# Altium schematic sheet 02-Insence_interface_xx.SchDoc
size C; SheetNumber: 2
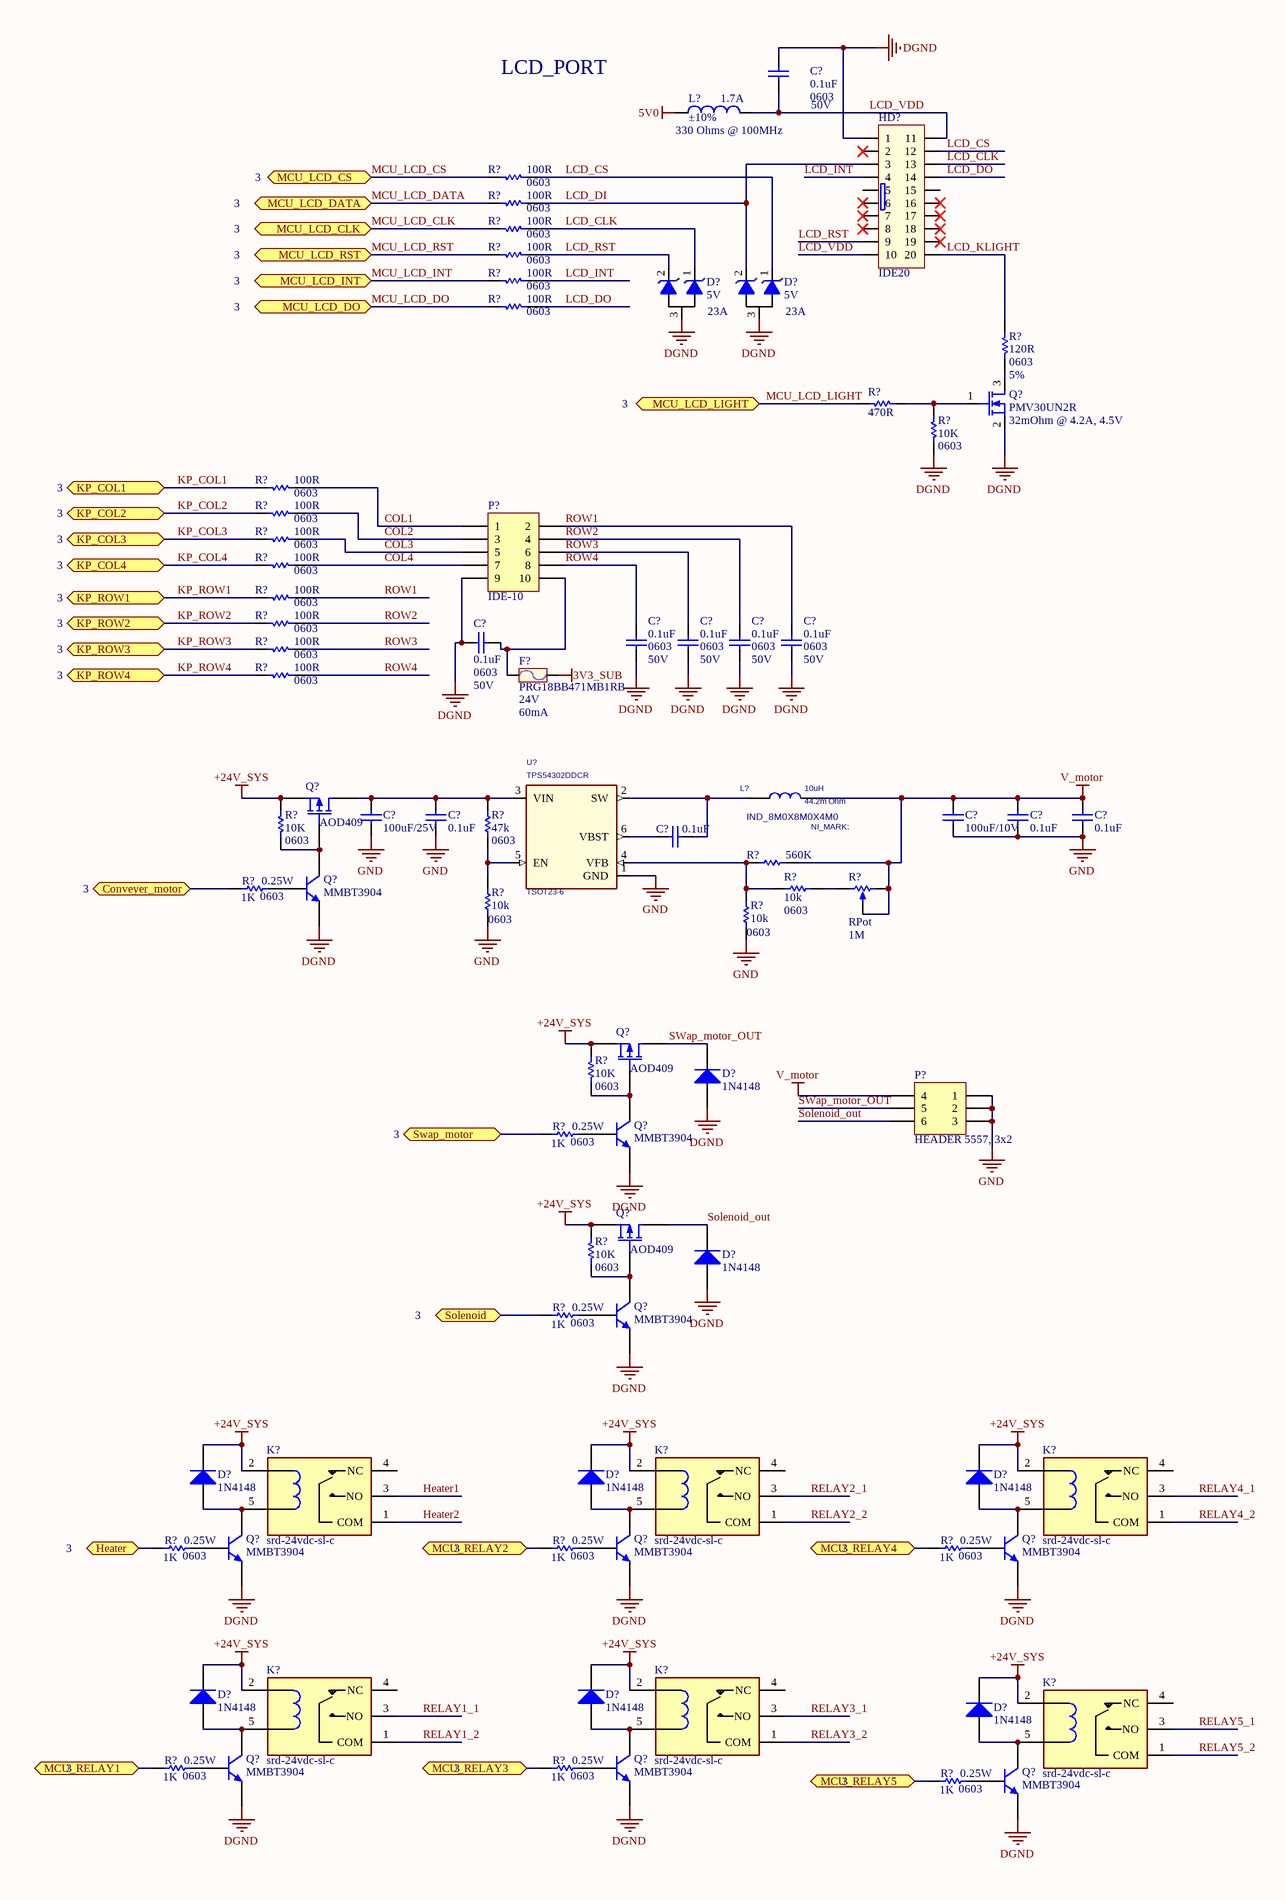
[diagram p0: 02-Insence_interface_xx.SchDoc, left]
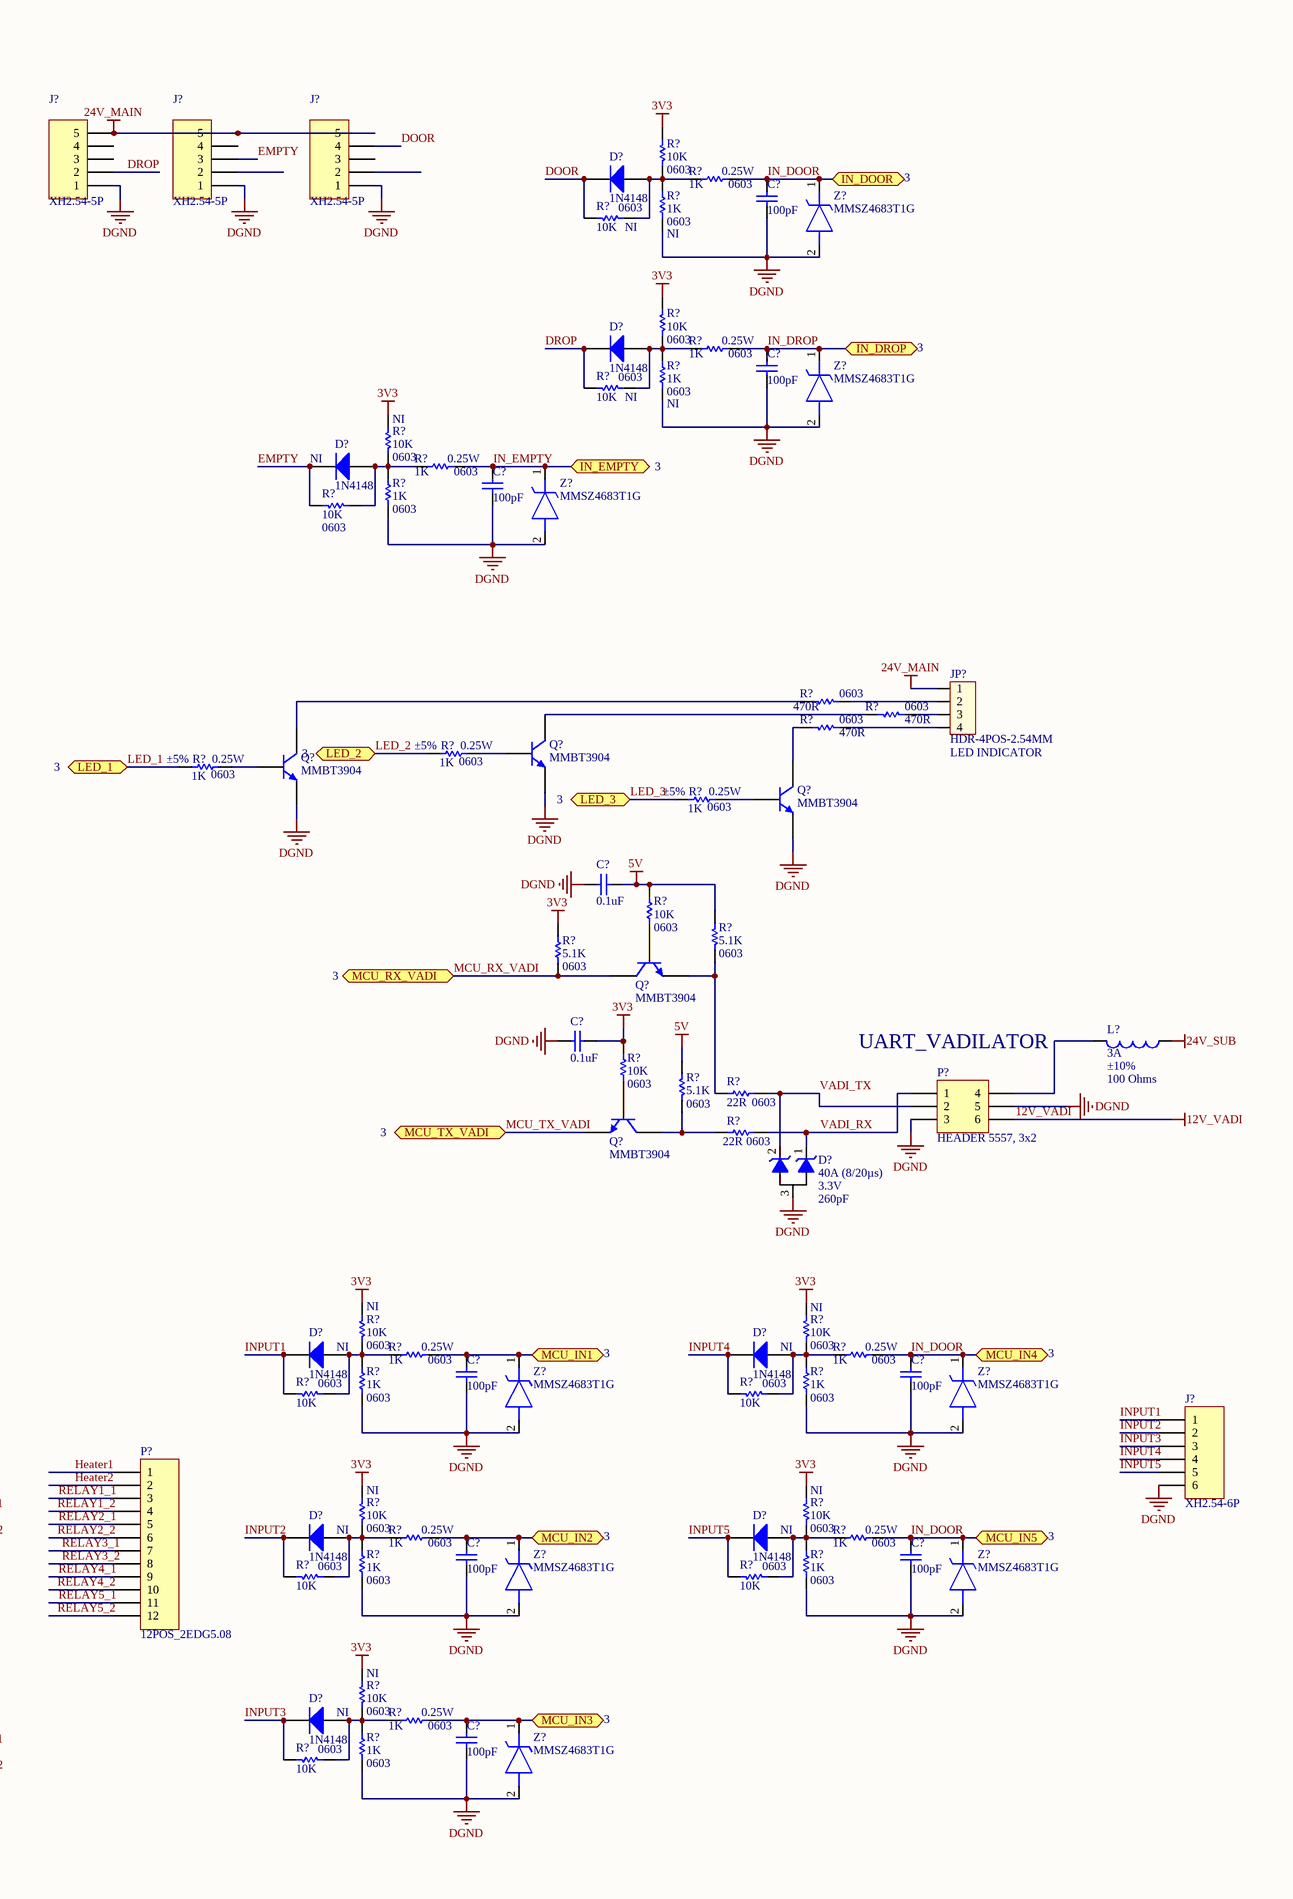
[diagram p1: 02-Insence_interface_xx.SchDoc, right]

## Parts
(Parts that share a designator on the sheet are numbered #1, #2 ... from top to bottom, then left to right.)
C?#1  FOOTPRINT: 0603  Voltage: 50V  [CAP 0603]  (hidden comment: 0.1uF)
C?#2  100pF  [CAP 0603]
C?#3  100pF  [CAP 0603]
C?#4  100pF  [CAP 0603]
C?#5  FOOTPRINT: 0603  Voltage: 50V  [CAP 0603]  (hidden comment: 0.1uF)
C?#6  FOOTPRINT: 0603  Voltage: 50V  [CAP 0603]  (hidden comment: 0.1uF)
C?#7  FOOTPRINT: 0603  Voltage: 50V  [CAP 0603]  (hidden comment: 0.1uF)
C?#8  FOOTPRINT: 0603  Voltage: 50V  [CAP 0603]  (hidden comment: 0.1uF)
C?#9  FOOTPRINT: 0603  Voltage: 50V  [CAP 0603]  (hidden comment: 0.1uF)
C?#10  =Value: 100uF/25V  [SMC_E/WA]  (hidden comment: Capacitor Tantalum,100uF,25V, 7343)
C?#11  =Value: 0.1uF  [0805]  (hidden comment: Cap)
C?#12  =Value: 0.1uF  [0805]  (hidden comment: Cap)
C?#13  =Value: 100uF/10V  [SMC_D/WA]  (hidden comment: Cap)
C?#14  =Value: 0.1uF  [0805]  (hidden comment: Cap)
C?#15  =Value: 0.1uF  [0805]  (hidden comment: Cap)
C?#16  0.1uF  [CAP 0603]
C?#17  0.1uF  [CAP 0603]
C?#18  100pF  [CAP 0603]
C?#19  100pF  [CAP 0603]
C?#20  100pF  [CAP 0603]
C?#21  100pF  [CAP 0603]
C?#22  100pF  [CAP 0603]
D?#1  1N4148  [diode_1206]
D?#2  CURRENT: 23A  VOLTAGE: 5V  [SOT-23-3]  (hidden comment: HSM05-TP)
D?#3  CURRENT: 23A  VOLTAGE: 5V  [SOT-23-3]  (hidden comment: HSM05-TP)
D?#4  1N4148  [diode_1206]
D?#5  1N4148  Assembly: NI  [diode_1206]
D?#6  1N4148  [diode_1206]
D?#7  CURRENT: 40A (8/20µs)  VOLTAGE: 3.3V  Junction Capacitance: 260pF  [SOT-23-3]  (hidden comment: SM3.3H-TP)
D?#8  1N4148  [diode_1206]
D?#9  1N4148  Assembly: NI  [diode_1206]
D?#10  1N4148  Assembly: NI  [diode_1206]
D?#11  1N4148  [diode_1206]
D?#12  1N4148  [diode_1206]
D?#13  1N4148  [diode_1206]
D?#14  1N4148  Assembly: NI  [diode_1206]
D?#15  1N4148  Assembly: NI  [diode_1206]
D?#16  1N4148  [diode_1206]
D?#17  1N4148  [diode_1206]
D?#18  1N4148  [diode_1206]
D?#19  1N4148  Assembly: NI  [diode_1206]
F?  PRG18BB471MB1RB  Voltage - Rated: 24V  Current Rating (Amps): 60mA  [FB 0603]
HD?  IDE20  [SHDR20W65P254_2X10_3302X900X900P]
J?#1  XH2.54-5P  [HDR1X5]
J?#2  XH2.54-5P  [HDR1X5]
J?#3  XH2.54-5P  [HDR1X5]
J?#4  XH2.54-6P  [HDR1X6]
JP?  HDR-4POS-2.54MM  CONNECTION: LED INDICATOR  [XH2.54-4P]
K?#1  srd-24vdc-sl-c  [srd24vdcslc]
K?#2  srd-24vdc-sl-c  [srd24vdcslc]
K?#3  srd-24vdc-sl-c  [srd24vdcslc]
K?#4  srd-24vdc-sl-c  [srd24vdcslc]
K?#5  srd-24vdc-sl-c  [srd24vdcslc]
K?#6  srd-24vdc-sl-c  [srd24vdcslc]
L?#1  Current: 1.7A  Tolerance: ±10%  [FB 0603]  (hidden comment: 330 Ohms @ 100MHz)
L?#2  10uH  PACKAGE: IND_8M0X8M0X4M0  DCR: 44.2m Ohm  [Inductor_5X5]
L?#3  value 100 Ohms  Current: 3A  Tolerance: ±10%  [FB 0603]  (hidden comment: MPZ1608S101ATAH0)
P?#1  IDE-10  [IDE-10]
P?#2  HEADER 5557, 3x2  [HDR2X3_CEN]
P?#3  HEADER 5557, 3x2  [HDR2X3_CEN]
P?#4  12POS_2EDG5.08  [Jack_12_2EDG508]
Q?#1  PMV30UN2R  RDSON: 32mOhm @ 4.2A, 4.5V  [SOT-23-3]
Q?#2  MMBT3904  [SOT-23]
Q?#3  MMBT3904  [SOT-23]
Q?#4  MMBT3904  [SOT-23]
Q?#5  AOD409  [E3]
Q?#6  MMBT3904  [SOT-23]
Q?#7  MMBT3904  [SOT-23]
Q?#8  AOD409  [E3]
Q?#9  MMBT3904  [SOT-23]
Q?#10  MMBT3904  [SOT-23]
Q?#11  AOD409  [E3]
Q?#12  MMBT3904  [SOT-23]
Q?#13  MMBT3904  [SOT-23]
Q?#14  MMBT3904  [SOT-23]
Q?#15  MMBT3904  [SOT-23]
Q?#16  MMBT3904  [SOT-23]
Q?#17  MMBT3904  [SOT-23]
Q?#18  MMBT3904  [SOT-23]
R?#1  PCB Footprint: 0603  [res 0603]  (hidden comment: 10K)
R?#2  PCB_ Footprint: 0603  [res 0603]  (hidden comment: 100R)
R?#3  PCB Footprint: 0603  Assembly: NI  [res 0603]  (hidden comment: 1K)
R?#4  PCB Footprint: 0603  Power: 0.25W  [res 0603]  (hidden comment: 1K)
R?#5  PCB_ Footprint: 0603  [res 0603]  (hidden comment: 100R)
R?#6  PCB Footprint: 0603  Assembly: NI  [res 0603]  (hidden comment: 10K)
R?#7  PCB_ Footprint: 0603  [res 0603]  (hidden comment: 100R)
R?#8  PCB_ Footprint: 0603  [res 0603]  (hidden comment: 100R)
R?#9  PCB_ Footprint: 0603  [res 0603]  (hidden comment: 100R)
R?#10  PCB Footprint: 0603  [res 0603]  (hidden comment: 10K)
R?#11  PCB_ Footprint: 0603  [res 0603]  (hidden comment: 100R)
R?#12  PCB_ Footprint: 0603  Tolerance: 5%  [res 0603]  (hidden comment: 120R)
R?#13  PCB Footprint: 0603  Assembly: NI  [res 0603]  (hidden comment: 1K)
R?#14  PCB Footprint: 0603  Power: 0.25W  [res 0603]  (hidden comment: 1K)
R?#15  470R  [res 0603]
R?#16  PCB Footprint: 0603  Assembly: NI  [res 0603]  (hidden comment: 10K)
R?#17  PCB Footprint: 0603  [res 0603]  (hidden comment: 10K)
R?#18  PCB Footprint: 0603  Asembly: NI  [res 0603]  (hidden comment: 10K)
R?#19  PCB Footprint: 0603  [res 0603]  (hidden comment: 1K)
R?#20  PCB Footprint: 0603  Power: 0.25W  [res 0603]  (hidden comment: 1K)
R?#21  PCB_ Footprint: 0603  [res 0603]  (hidden comment: 100R)
R?#22  PCB Footprint: 0603  [res 0603]  (hidden comment: 10K)
R?#23  PCB_ Footprint: 0603  [res 0603]  (hidden comment: 100R)
R?#24  PCB_ Footprint: 0603  [res 0603]  (hidden comment: 100R)
R?#25  PCB_ Footprint: 0603  [res 0603]  (hidden comment: 100R)
R?#26  PCB_ Footprint: 0603  [res 0603]  (hidden comment: 100R)
R?#27  PCB_ Footprint: 0603  [res 0603]  (hidden comment: 100R)
R?#28  PCB_ Footprint: 0603  [res 0603]  (hidden comment: 100R)
R?#29  PCB Footprint: 0603  [res 0603]  (hidden comment: 470R)
R?#30  PCB_ Footprint: 0603  [res 0603]  (hidden comment: 100R)
R?#31  PCB Footprint: 0603  [res 0603]  (hidden comment: 470R)
R?#32  PCB Footprint: 0603  [res 0603]  (hidden comment: 470R)
R?#33  PCB Footprint: 0603  Power: 0.25W  Tolerance: ±5%  [res 0603]  (hidden comment: 1K)
R?#34  PCB Footprint: 0603  Power: 0.25W  Tolerance: ±5%  [res 0603]  (hidden comment: 1K)
R?#35  PCB Footprint: 0603  Power: 0.25W  Tolerance: ±5%  [res 0603]  (hidden comment: 1K)
R?#36  PCB Footprint: 0603  [res 0603]  (hidden comment: 10K)
R?#37  value 47k  Footprint: 0603  [res 0603]  (hidden comment: Res1)
R?#38  value 560K  [0805]  (hidden comment: Res1)
R?#39  value 10k  Footprint: 0603  [res 0603]  (hidden comment: Res1)
R?#40  value 10k  Footprint: 0603  [res 0603]  (hidden comment: Res1)
R?#41  PCB Footprint: 0603  [res 0603]  (hidden comment: 10K)
R?#42  PCB Footprint: 0603  Power: 0.25W  [res 0603]  (hidden comment: 1K)
R?#43  value 10k  Footprint: 0603  [res 0603]  (hidden comment: Res1)
R?#44  RPot  value 1M  [VR5]
R?#45  PCB Footprint: 0603  [res 0603]  (hidden comment: 5.1K)
R?#46  PCB Footprint: 0603  [res 0603]  (hidden comment: 5.1K)
R?#47  PCB Footprint: 0603  [res 0603]  (hidden comment: 10K)
R?#48  PCB Footprint: 0603  [res 0603]  (hidden comment: 10K)
R?#49  PCB Footprint: 0603  [res 0603]  (hidden comment: 5.1K)
R?#50  PCB Footprint: 0603  [res 0603]  (hidden comment: 22R)
R?#51  PCB Footprint: 0603  [res 0603]  (hidden comment: 22R)
R?#52  PCB Footprint: 0603  Power: 0.25W  [res 0603]  (hidden comment: 1K)
R?#53  PCB Footprint: 0603  [res 0603]  (hidden comment: 10K)
R?#54  PCB Footprint: 0603  Assembly: NI  [res 0603]  (hidden comment: 10K)
R?#55  PCB Footprint: 0603  Assembly: NI  [res 0603]  (hidden comment: 10K)
R?#56  PCB Footprint: 0603  Power: 0.25W  [res 0603]  (hidden comment: 1K)
R?#57  PCB Footprint: 0603  [res 0603]  (hidden comment: 1K)
R?#58  PCB Footprint: 0603  Power: 0.25W  [res 0603]  (hidden comment: 1K)
R?#59  PCB Footprint: 0603  [res 0603]  (hidden comment: 1K)
R?#60  PCB Footprint: 0603  Power: 0.25W  [res 0603]  (hidden comment: 1K)
R?#61  PCB Footprint: 0603  [res 0603]  (hidden comment: 10K)
R?#62  PCB Footprint: 0603  [res 0603]  (hidden comment: 10K)
R?#63  PCB Footprint: 0603  Assembly: NI  [res 0603]  (hidden comment: 10K)
R?#64  PCB Footprint: 0603  Assembly: NI  [res 0603]  (hidden comment: 10K)
R?#65  PCB Footprint: 0603  [res 0603]  (hidden comment: 1K)
R?#66  PCB Footprint: 0603  Power: 0.25W  [res 0603]  (hidden comment: 1K)
R?#67  PCB Footprint: 0603  [res 0603]  (hidden comment: 1K)
R?#68  PCB Footprint: 0603  Power: 0.25W  [res 0603]  (hidden comment: 1K)
R?#69  PCB Footprint: 0603  Power: 0.25W  [res 0603]  (hidden comment: 1K)
R?#70  PCB Footprint: 0603  Power: 0.25W  [res 0603]  (hidden comment: 1K)
R?#71  PCB Footprint: 0603  Power: 0.25W  [res 0603]  (hidden comment: 1K)
R?#72  PCB Footprint: 0603  [res 0603]  (hidden comment: 10K)
R?#73  PCB Footprint: 0603  [res 0603]  (hidden comment: 10K)
R?#74  PCB Footprint: 0603  Assembly: NI  [res 0603]  (hidden comment: 10K)
R?#75  PCB Footprint: 0603  [res 0603]  (hidden comment: 1K)
R?#76  PCB Footprint: 0603  Power: 0.25W  [res 0603]  (hidden comment: 1K)
R?#77  PCB Footprint: 0603  [res 0603]  (hidden comment: 10K)
R?#78  PCB Footprint: 0603  Power: 0.25W  [res 0603]  (hidden comment: 1K)
R?#79  PCB Footprint: 0603  Power: 0.25W  [res 0603]  (hidden comment: 1K)
R?#80  PCB Footprint: 0603  Power: 0.25W  [res 0603]  (hidden comment: 1K)
U?  TPS54302DDCR  PACKAGE: TSOT23-6  [SOT23-6]
Z?#1  MMSZ4683T1G  [SOD3716X135N]
Z?#2  MMSZ4683T1G  [SOD3716X135N]
Z?#3  MMSZ4683T1G  [SOD3716X135N]
Z?#4  MMSZ4683T1G  [SOD3716X135N]
Z?#5  MMSZ4683T1G  [SOD3716X135N]
Z?#6  MMSZ4683T1G  [SOD3716X135N]
Z?#7  MMSZ4683T1G  [SOD3716X135N]
Z?#8  MMSZ4683T1G  [SOD3716X135N]

## Ports
Conveyer_motor (bidir, see 3), Heater (bidir, see 3), IN_DOOR (bidir, see 3), IN_DROP (bidir, see 3), IN_EMPTY (bidir, see 3), KP_COL1 (bidir, see 3), KP_COL2 (bidir, see 3), KP_COL3 (bidir, see 3), KP_COL4 (bidir, see 3), KP_ROW1 (bidir, see 3), KP_ROW2 (bidir, see 3), KP_ROW3 (bidir, see 3), KP_ROW4 (bidir, see 3), LED_1 (bidir, see 3), LED_2 (bidir, see 3), LED_3 (bidir, see 3), MCU_IN1 (bidir, see 3), MCU_IN2 (bidir, see 3), MCU_IN3 (bidir, see 3), MCU_IN4 (bidir, see 3), MCU_IN5 (bidir, see 3), MCU_LCD_CLK (bidir, see 3), MCU_LCD_CS (bidir, see 3), MCU_LCD_DATA (bidir, see 3), MCU_LCD_DO (bidir, see 3), MCU_LCD_INT (bidir, see 3), MCU_LCD_LIGHT (bidir, see 3), MCU_LCD_RST (bidir, see 3), MCU_RELAY1 (bidir, see 3), MCU_RELAY2 (bidir, see 3), MCU_RELAY3 (bidir, see 3), MCU_RELAY4 (bidir, see 3), MCU_RELAY5 (bidir, see 3), MCU_RX_VADI (bidir, see 3), MCU_TX_VADI (bidir, see 3), Solenoid (bidir, see 3), Swap_motor (bidir, see 3)

## Nets
3V3: C?#17.2 R?#1.1 R?#10.1 R?#18.1 R?#46.1 R?#47.1 R?#54.1 R?#55.1 R?#63.1 R?#64.1 R?#74.1
3V3_SUB: F?.1
5V: C?#16.1 R?#41.1 R?#45.1 R?#49.1
5V0: L?#1.1
12V_VADI: P?#2.6
24V_MAIN: J?#1.5 J?#2.5 J?#3.5 JP?.1
24V_SUB: L?#3.1
+24V_SYS: D?#11.2(K) D?#12.2(K) D?#13.2(K) D?#16.2(K) D?#17.2(K) D?#18.2(K) K?#1.2(COIL_1) K?#2.2(COIL_1) K?#3.2(COIL_1) K?#4.2(COIL_1) K?#5.2(COIL_1) K?#6.2(COIL_1) Q?#5.3(S) Q?#8.3(S) Q?#11.3(S) R?#36.1 R?#48.1 R?#53.1
DGND: C?#1.1 C?#2.1 C?#3.1 C?#4.1 C?#5.1 C?#6.1 C?#7.1 C?#8.1 C?#9.1 C?#16.2 C?#17.1 C?#18.1 C?#19.1 C?#20.1 C?#21.1 C?#22.1 D?#2.3(A) D?#3.3(A) D?#6.1(A) D?#7.3(A) D?#8.1(A) HD?.1 J?#1.1 J?#2.1 J?#3.1 J?#4.6 P?#1.9 P?#2.3 P?#2.5 Q?#1.2(S) Q?#2.2(E) Q?#3.2(E) Q?#4.2(E) Q?#6.2(E) Q?#10.2(E) Q?#12.2(E) Q?#13.2(E) Q?#14.2(E) Q?#15.2(E) Q?#16.2(E) Q?#17.2(E) Q?#18.2(E) R?#3.2 R?#13.2 R?#17.2 R?#19.2 R?#57.2 R?#59.2 R?#65.2 R?#67.2 R?#75.2 Z?#1.2(A) Z?#2.2(A) Z?#3.2(A) Z?#4.2(A) Z?#5.2(A) Z?#6.2(A) Z?#7.2(A) Z?#8.2(A)
GND: C?#10.1 C?#11.1 C?#13.1 C?#14.1 C?#15.1 P?#3.1 P?#3.2 P?#3.3 R?#40.2 R?#43.2 U?.1(GND)
V_motor: C?#13.2 C?#14.2 C?#15.2 L?#2.2(B) P?#3.4 R?#38.2 R?#44.2(BOT) R?#44.3(TAP)
COL1: P?#1.1 R?#21.2
COL2: P?#1.3 R?#23.2
COL3: P?#1.5 R?#24.2
COL4: P?#1.7 R?#25.2
Conveyer_motor: R?#42.2 ; port Conveyer_motor
DOOR: D?#1.2(K) J?#3.4 R?#6.1
DROP: D?#4.2(K) J?#1.2 R?#16.1
EMPTY: D?#5.2(K) J?#2.3 R?#22.1
Heater: R?#69.2 ; port Heater
Heater1: K?#1.3(NO) P?#4.1
Heater2: K?#1.1(COM) P?#4.2
IN_DOOR: C?#2.2 C?#19.2 C?#21.2 R?#4.1 R?#60.1 R?#68.1 Z?#1.1(K) Z?#5.1(K) Z?#7.1(K) ; port IN_DOOR, port MCU_IN4, port MCU_IN5
IN_DROP: C?#3.2 R?#14.1 Z?#2.1(K) ; port IN_DROP
IN_EMPTY: C?#4.2 R?#20.1 Z?#3.1(K) ; port IN_EMPTY
INPUT1: D?#9.2(K) J?#4.1 R?#61.1
INPUT2: D?#14.2(K) J?#4.2 R?#72.1
INPUT3: D?#19.2(K) J?#4.3 R?#77.1
INPUT4: D?#10.2(K) J?#4.4 R?#62.1
INPUT5: D?#15.2(K) J?#4.5 R?#73.1
KP_COL1: R?#21.1 ; port KP_COL1
KP_COL2: R?#23.1 ; port KP_COL2
KP_COL3: R?#24.1 ; port KP_COL3
KP_COL4: R?#25.1 ; port KP_COL4
KP_ROW1: R?#26.1 ; port KP_ROW1
KP_ROW2: R?#27.1 ; port KP_ROW2
KP_ROW3: R?#28.1 ; port KP_ROW3
KP_ROW4: R?#30.1 ; port KP_ROW4
LCD_CLK: D?#2.1(K) HD?.13 R?#7.2
LCD_CS: D?#3.1(K) HD?.12 R?#2.2
LCD_DI: D?#3.2(K) HD?.3 R?#5.2
LCD_DO: HD?.14 R?#11.2
LCD_INT: HD?.4 R?#9.2
LCD_KLIGHT: HD?.20 R?#12.1
LCD_RST: D?#2.2(K) HD?.9 R?#8.2
LCD_VDD: C?#1.2 HD?.10 HD?.11 L?#1.2
LED_1: R?#34.2 ; port LED_1
LED_2: R?#33.2 ; port LED_2
LED_3: R?#35.2 ; port LED_3
MCU_IN1: C?#18.2 R?#58.1 Z?#4.1(K) ; port MCU_IN1
MCU_IN2: C?#20.2 R?#66.1 Z?#6.1(K) ; port MCU_IN2
MCU_IN3: C?#22.2 R?#76.1 Z?#8.1(K) ; port MCU_IN3
MCU_LCD_CLK: R?#7.1 ; port MCU_LCD_CLK
MCU_LCD_CS: R?#2.1 ; port MCU_LCD_CS
MCU_LCD_DATA: R?#5.1 ; port MCU_LCD_DATA
MCU_LCD_DO: R?#11.1 ; port MCU_LCD_DO
MCU_LCD_INT: R?#9.1 ; port MCU_LCD_INT
MCU_LCD_LIGHT: R?#15.2 ; port MCU_LCD_LIGHT
MCU_LCD_RST: R?#8.1 ; port MCU_LCD_RST
MCU_RELAY1: R?#78.2 ; port MCU_RELAY1
MCU_RELAY2: R?#70.2 ; port MCU_RELAY2
MCU_RELAY3: R?#79.2 ; port MCU_RELAY3
MCU_RELAY4: R?#71.2 ; port MCU_RELAY4
MCU_RELAY5: R?#80.2 ; port MCU_RELAY5
MCU_RX_VADI: Q?#7.3(C) R?#46.2 ; port MCU_RX_VADI
MCU_TX_VADI: Q?#9.2(E) ; port MCU_TX_VADI
RELAY1_1: K?#4.3(NO) P?#4.3
RELAY1_2: K?#4.1(COM) P?#4.4
RELAY2_1: K?#2.3(NO) P?#4.5
RELAY2_2: K?#2.1(COM) P?#4.6
RELAY3_1: K?#5.3(NO) P?#4.7
RELAY3_2: K?#5.1(COM) P?#4.8
RELAY4_1: K?#3.3(NO) P?#4.9
RELAY4_2: K?#3.1(COM) P?#4.10
RELAY5_1: K?#6.3(NO) P?#4.11
RELAY5_2: K?#6.1(COM) P?#4.12
ROW1: C?#8.2 P?#1.2 R?#26.2
ROW2: C?#7.2 P?#1.4 R?#27.2
ROW3: C?#6.2 P?#1.6 R?#28.2
ROW4: C?#5.2 P?#1.8 R?#30.2
Solenoid: R?#56.2 ; port Solenoid
Solenoid_out: D?#8.2(K) P?#3.6 Q?#11.1(D)
Swap_motor: R?#52.2 ; port Swap_motor
SWap_motor_OUT: D?#6.2(K) P?#3.5 Q?#8.1(D)
VADI_RX: D?#7.1(K) P?#2.1 R?#51.2
VADI_TX: D?#7.2(K) P?#2.2 R?#50.2
NetC?#9_2: C?#9.2 F?.2 P?#1.10
NetC?#10_2: C?#10.2 C?#11.2 Q?#5.1(D) R?#37.2 U?.3(VIN)
NetC?#12_1: C?#12.1 U?.6(VBST)
NetC?#12_2: C?#12.2 L?#2.1(A) U?.2(SW)
NetD?#1_1: D?#1.1(A) R?#1.2 R?#3.1 R?#4.2 R?#6.2
NetD?#4_1: D?#4.1(A) R?#10.2 R?#13.1 R?#14.2 R?#16.2
NetD?#5_1: D?#5.1(A) R?#18.2 R?#19.1 R?#20.2 R?#22.2
NetD?#9_1: D?#9.1(A) R?#54.2 R?#57.1 R?#58.2 R?#61.2
NetD?#10_1: D?#10.1(A) R?#55.2 R?#59.1 R?#60.2 R?#62.2
NetD?#11_1: D?#11.1(A) K?#1.5(COIL_2) Q?#13.3(C)
NetD?#12_1: D?#12.1(A) K?#2.5(COIL_2) Q?#14.3(C)
NetD?#13_1: D?#13.1(A) K?#3.5(COIL_2) Q?#15.3(C)
NetD?#14_1: D?#14.1(A) R?#63.2 R?#65.1 R?#66.2 R?#72.2
NetD?#15_1: D?#15.1(A) R?#64.2 R?#67.1 R?#68.2 R?#73.2
NetD?#16_1: D?#16.1(A) K?#4.5(COIL_2) Q?#16.3(C)
NetD?#17_1: D?#17.1(A) K?#5.5(COIL_2) Q?#17.3(C)
NetD?#18_1: D?#18.1(A) K?#6.5(COIL_2) Q?#18.3(C)
NetD?#19_1: D?#19.1(A) R?#74.2 R?#75.1 R?#76.2 R?#77.2
NetJP?_2: JP?.2 R?#29.1
NetJP?_3: JP?.3 R?#31.1
NetJP?_4: JP?.4 R?#32.1
NetL?#3_2: L?#3.2 P?#2.4
NetQ?#1_1: Q?#1.1(G) R?#15.1 R?#17.1
NetQ?#1_3: Q?#1.3(D) R?#12.2
NetQ?#2_1: Q?#2.1(B) R?#33.1
NetQ?#2_3: Q?#2.3(C) R?#31.2
NetQ?#3_1: Q?#3.1(B) R?#34.1
NetQ?#3_3: Q?#3.3(C) R?#29.2
NetQ?#4_1: Q?#4.1(B) R?#35.1
NetQ?#4_3: Q?#4.3(C) R?#32.2
NetQ?#5_2: Q?#5.2(G) Q?#6.3(C) R?#36.2
NetQ?#6_1: Q?#6.1(B) R?#42.1
NetQ?#7_1: Q?#7.1(B) R?#41.2
NetQ?#7_2: Q?#7.2(E) R?#45.2 R?#50.1
NetQ?#8_2: Q?#8.2(G) Q?#10.3(C) R?#48.2
NetQ?#9_1: Q?#9.1(B) R?#47.2
NetQ?#9_3: Q?#9.3(C) R?#49.2 R?#51.1
NetQ?#10_1: Q?#10.1(B) R?#52.1
NetQ?#11_2: Q?#11.2(G) Q?#12.3(C) R?#53.2
NetQ?#12_1: Q?#12.1(B) R?#56.1
NetQ?#13_1: Q?#13.1(B) R?#69.1
NetQ?#14_1: Q?#14.1(B) R?#70.1
NetQ?#15_1: Q?#15.1(B) R?#71.1
NetQ?#16_1: Q?#16.1(B) R?#78.1
NetQ?#17_1: Q?#17.1(B) R?#79.1
NetQ?#18_1: Q?#18.1(B) R?#80.1
NetR?#37_1: R?#37.1 R?#40.1 U?.5(EN)
NetR?#38_1: R?#38.1 R?#39.1 R?#43.1 U?.4(VFB)
NetR?#39_2: R?#39.2 R?#44.1(TOP)

Not connected (* = marked no-connect by the designer): HD? 2* 5 6* 7* 8* 15 16* 17* 18* 19*; J?#1 3 4; J?#2 2 4; J?#3 2 3; K?#1 4(NC); K?#2 4(NC); K?#3 4(NC); K?#4 4(NC); K?#5 4(NC); K?#6 4(NC)

## Notes on the sheet
- LCD_PORT
- (near P?#2) UART_VADILATOR

## Library data of the parts
C?#1 C?#5-C?#9 = Cap_0.1uF: CAP-CER,SMD;0.1uF,5%,0603,50V,X7R; MANUFACTURER1_PART#: CL10B104KB8NNNC; MANUFACTURER1: SS; MANU1: Samsung Electro-Mechanics; PROC: SM; Unit: PCS; Tolerance: ±10%; CATEGORY: CAP-CER; VALUE: 0.1uF; Material: X7R
C?#2-C?#4 C?#18-C?#22 = Cap: CAP CER 100PF 50V C0G/NPO 0603; MANUFACTURER1: Samsung Electro-Mechanics; MANUFACTURER1_PART#: CL10C101JC8NNNC; MANUFACTURER2_PART#: CC0603JRNPO9BN101; Unit: PCS; PACKING: Tape & Reel (TR); PCB FOOTPRINT: 0603; Process Type: SM; Tolerance: ±10%; CATEGORY: CAP-CER; VALUE: 100pF; FOOTPRINT: 0603; Material: C0G/NPO; Voltage: 50V; MANUFACTURER2: Yageo
C?#10 = Cap: Capacitor Tantalum 7343; Published: 8-Jun-2000; LatestRevisionDate: 17-Jul-2002; LatestRevisionNote: Re-released for DXP Platform.; PackageReference: RAD-0.3; Publisher: Altium Limited; PackageDescription: Radial Cap, Thru-Hole; 2 Leads; 0.3 in Pin Spacing
C?#11 C?#12 C?#14 C?#15 = Cap: cap,0805,0.1uF,16V; Published: 8-Jun-2000; LatestRevisionDate: 17-Jul-2002; LatestRevisionNote: Re-released for DXP Platform.; PackageReference: RAD-0.3; Publisher: Altium Limited; PackageDescription: Radial Cap, Thru-Hole; 2 Leads; 0.3 in Pin Spacing
C?#13 = Cap: Capacitor Tantalum,100uF,10V,3528; Published: 8-Jun-2000; LatestRevisionDate: 17-Jul-2002; LatestRevisionNote: Re-released for DXP Platform.; PackageReference: RAD-0.3; Publisher: Altium Limited; PackageDescription: Radial Cap, Thru-Hole; 2 Leads; 0.3 in Pin Spacing
C?#16 C?#17 = Cap: CAP-CER,SMD;0.1UF,10%,50V,X7R,0603; MANUFACTURER1: Samsung Electro-Mechanics; MANUFACTURER1_PART#: CL10B104KB8NNNC; MANUFACTURER2_PART#: M0603X104K050TAX; MANUFACTURER1: SS; Unit: PCS; PACKING: Tape & Reel (TR); PCB FOOTPRINT: 0603; Process Type: SM; CATEGORY: CAP-CER; VALUE: 0.1uF; FOOTPRINT: 0603; Material: X7R; Voltage: 50V; Tolerance: ±10%; MANUFACTURER2: UWA
D?#1 D?#4-D?#6 D?#8-D?#19 = Diode: Default Diode; Published: 8-Jun-2000; LatestRevisionDate: 17-Jul-2002; LatestRevisionNote: Re-released for DXP Platform.; PackageVersion: Sep-1996; PackageReference: SMC; Publisher: Altium Limited; PackageDescription: DO-214-AB/SMC; 2 C-Bend Leads; Body 7.9 x 5.9 mm, inc. leads (LxW); Code_JEDEC: DO-214-AB
D?#2 D?#3 = TVS_DUAL_5V_SOT23: 5V, ESD PROTECTION DEVICES, SOT-; MANUFACTURER2_PART#: SM05-7; MANUFACTURER1: Micro Commercial Co; POWER: 320W; Category: TVS; MANUFACTURER1_PART#: HSM05-TP; MANUFACTURER2: Diodes; Value: *; LOH_CODE: *
D?#7 = TVS_DUAL_3V3_SOT23: 3.3V, ESD PROTECTION DEVICES, SO; MANUFACTURER2_PART#: GSOT03C-E3-08; MANUFACTURER1: Micro Commercial Co; POWER: 500W; Category: TVS; MANUFACTURER1_PART#: SM3.3H-TP; MANUFACTURER2: Vishay; Value: SM3.3H-TP; LOH_CODE: *
F? = 0875.800MXEP: PTC RESET FUSE 24V 10MA 0603; MANUFACTURER1: Murata Electronics; PROCESS_TYPE: MA; Unit: PCS; Response Time: Slow Blow; Breaking Capacity @ Rated Voltage: 0.06A; Melting I²t: 0.919; Value: CLA1683; DC Cold Resistance: 0.116 Ohms; CATEGORY: FUSE; MANUFACTURER1_PART#: PRG18BB471MB1RB; Package / Case: 0603
HD? = IDC 10X2: MANUFACTURER1_PART#: 3020-20-0100-00; MANUFACTURER2_PART#: C3405; MANUFACTURER1: CNC Tech; Value: IDE20; MANUFACTURER2: BOOMELE(Boom Precision Elec); Category: CONNECTOR
J?#1-J?#3 = Header 5: Header, 5-Pin; LatestRevisionDate: 17-Jul-2002; LatestRevisionNote: Re-released for DXP Platform.; Publisher: Altium Limited
J?#4 = Header 6: Header, 6-Pin; LatestRevisionDate: 17-Jul-2002; LatestRevisionNote: Re-released for DXP Platform.; Publisher: Altium Limited
JP? = Con-4P-HDR-2M54: Value: HDR-4POS-2.54MM; NI_MARK: *; MANUFACTURER2_PART#: *; MANUFACTURER2: *; MANUFACTURER1_PART#: XH2.54-4P; MANUFACTURER1: http://linhkienchatluong.vn/; Category: HEADER
K?#1-K?#6 = srd-24vdc-sl-c: Relay or Contactor; Manufacturer_Name: EAGLE; Datasheet Link: https://pdf1.alldatasheet.com/datasheet-pdf/view/1132032/SONGLERELAY/SRD-24VDC-SL-C.html; Height: 15.3mm; Manufacturer_Part_Number: srd-24vdc-sl-c
L?#1 = inductor 2.2uF: FERRITE BEAD 330 OHM 0603 1LN; MANUFACTURER1: TDK Corporation; MANUFACTURER1_PART#: MPZ1608S331ATA00; MANUFACTURER2_PART#: BLM18KG331SN1D; PACKING: Tape & Reel (TR); PCB Footprint: 0603; Process Type: SM; Unit: PCS; Category: Inductor; DESCRIPTION_: FERRITE BEAD 330 OHM 0603 1LN; MANUFACTURER2: Murata Electronics; Value: 330 Ohms @ 100MHz
L?#2 = IND_10uH_3.1A_44.2mOhm_8MX8MX4M: IND-SMD;10uH,20%,8x8x4mm,3.1A,44.2mOHM; MFG1_PART#: NR8040T100M; DISTR1_PART#: 587-2001-2-ND; PSpice Template: L^@REFDES %A %B @ MODEL @VALUE; BY: VINFAST_RD; MFG1: TAIYO YUDEN; PROCESS: SM; DISTR1: DIGIKEY; Current: 3.1A; Tolerance: 20%; Category: INDUCTOR; TYPE: IND-SMD; VFCODE: NR8040T100M; Tolerance6: 20%
L?#3 = inductor 2.2uF: FERRITE BEAD 100 OHM 0603 1LN; MANUFACTURER1: TDK Corporation; MANUFACTURER2_PART#: BLM18KG101TN1D; PACKING: Tape & Reel (TR); PCB Footprint: 0603; Process Type: SM; Unit: PCS; Category: Inductor; MANUFACTURER1_PART#: MPZ1608S101ATAH0; MANUFACTURER2: Murata Electronics
P?#1 = IDE10: Connector Header Through Hole 10 position 0.100" (2.54mm); MANUFACTURER1: CNC Tech; MANUFACTURER1_PART#: 3020-10-0100-00; MANUFACTURER2_PART#: C5665; Category: CONNECTOR; Value: IDE-10; MANUFACTURER2: BOOMELE(Boom Precision Elec); PITCH: 2.54mm
P?#2 P?#3 = Header 3X2A: Header, 3-Pin, Dual row; LatestRevisionDate: 17-Jul-2002; LatestRevisionNote: Re-released for DXP Platform.; Publisher: Altium Limited; Supplier 1: Mouser; Supplier Part Number 1: 538-39-28-1063
P?#4 = Header 12H: Header, 12-Pin, Right Angle; LatestRevisionDate: 17-Jul-2002; LatestRevisionNote: Re-released for DXP Platform.; Publisher: Altium Limited
Q?#1 = Si2302DS: MOSFET N-CH 20V 4.2A SOT23; MANUFACTURER1: Nexperia USA Inc.; Current - Continuous Drain: 4.2A (Ta); VGH: 1.2V, 4.5V; LOH_Code: *; Category: FET; Value: PMV30UN2R; MANUFACTURER1_PART#: PMV30UN2R; MANUFACTURER2: *; MANUFACTURER2_PART#: *
Q?#2-Q?#4 Q?#6 Q?#7 Q?#9 Q?#10 Q?#12-Q?#18 = NPN: NPN 200mA 40V 350mW SOT-23 Transistors; MANUFACTURER1: Guangdong Hottech; PROCESS_TYPE: SM; PACKAGE: SOT23; Category: TRANSISTOR; MANUFACTURER2: HT(Shenzhen Jinyu Semicon); MANUFACTURER2_PART#: MMBT3904; MANUFACTURER1_PART#: MMBT3904; Value: MMBT3904
Q?#5 Q?#8 Q?#11 = MOSFET-P: P-Channel MOSFET; Published: 8-Jun-2000; LatestRevisionDate: 17-Jul-2002; LatestRevisionNote: Re-released for DXP Platform.; PackageVersion: 1995/1996; PackageReference: E3; Publisher: Altium Limited; PackageDescription: TO, Flat Index; 3 In-Line, Axial Leads; Body Dia. 4.6mm; Lead Dia. 0.5 mm (max)
R?#1 R?#6 R?#10 R?#16-R?#18 R?#22 R?#36 R?#41 R?#47 R?#48 R?#53-R?#55 R?#61-R?#64 R?#72-R?#74 R?#77 = Res0.3: RES SMD,10K OHM 5% 1/10W 0603; MANUFACTURER1: Stackpole Electronics Inc; MANUFACTURER1_PART#: RMCF0603JT10K0; MANUFACTURER2_PART#: R0603J10KKDX; PACKING: Tape & Reel (TR); Process Type: SM; Unit: PCS; Power: 0.25W; Value: 10K; CATEGORY: RES-SMD; MANUFACTURER2: UWA; Tolerance: ±5%
R?#2 R?#5 R?#7-R?#9 R?#11 R?#21 R?#23-R?#28 R?#30 = RES 120 OHM 5% 1/10W 0603: MANUFACTURER1: Stackpole; MANUFACTURER1_PART#: RMCF0603JG100R; PROC: SM; Unit: PCS; CATEGORY: RES-SMD; VALUE: 100R; FOOTPRINT: 0603
R?#3 R?#13 R?#19 R?#57 R?#59 R?#65 R?#67 R?#75 = Res0.3: RES SMD,1K OHM,5%,1/10W,0603; MANUFACTURER1: Stackpole Electronics Inc; MANUFACTURER1_PART#: RMCF06031K00JNEAC; MANUFACTURER2_PART#: R0603J1KTG; DESCCRIPTION: RES SMD 1K OHM 5% 1/10W 0603; PACKING: Tape & Reel (TR); Process Type: SM; Unit: PCS; LOH_Code: 140100083; Power: 0.25W; Value: 1K; CATEGORY: RES SMD; MANUFACTURER2: UWA
R?#4 R?#14 R?#20 R?#33-R?#35 R?#42 R?#52 R?#56 R?#58 R?#60 R?#66 R?#68-R?#71 R?#76 R?#78-R?#80 = Res0.3: RES SMD,1K OHM,5%,1/10W,0603; MANUFACTURER1: Stackpole Electronics Inc; MANUFACTURER1_PART#: RMCF06031K00JNEAC; MANUFACTURER2_PART#: R0603J1KTG; DESCCRIPTION: RES SMD 1K OHM 5% 1/10W 0603; PACKING: Tape & Reel (TR); Process Type: SM; Unit: PCS; LOH_Code: 140100083; Value: 1K; CATEGORY: RES SMD; MANUFACTURER2: UWA
R?#12 = RES 120 OHM 5% 1/10W 0603: MANUFACTURER1: Stackpole; MANUFACTURER1_PART#: RMCF0603JG120R; PROC: SM; Unit: PCS; CATEGORY: RES-SMD; VALUE: 120R; FOOTPRINT: 0603
R?#15 = Res0.3: RES SMD, 470 OHM 5% 1/8W 0603; MANUFACTURER1: KOA Speer Electronics, Inc.; MANUFACTURER1_PART#: RK73B1JTTD471J; MANUFACTURER2_PART#: RMCF0603JT470R; PACKING: Tape & Reel (TR); PCB Footprint: 0603; Process Type: SM; Unit: PCS; Power: 0.25W; Value: 470R; CATEGORY: RES SMD; MANUFACTURER2: Stackpole; Tolerance: ±5%
R?#29 R?#31 R?#32 = Res0.3: RES SMD, 470 OHM 5% 1/8W 0603; MANUFACTURER1: KOA Speer Electronics, Inc.; MANUFACTURER1_PART#: RK73B1JTTD471J; MANUFACTURER2_PART#: RMCF0603JT470R; PACKING: Tape & Reel (TR); Process Type: SM; Unit: PCS; Power: 0.25W; Value: 470R; CATEGORY: RES SMD; MANUFACTURER2: Stackpole; Tolerance: ±5%
R?#37 R?#39 R?#40 R?#43 = Res1: Resistor; Published: 8-Jun-2000; LatestRevisionDate: 17-Jul-2002; LatestRevisionNote: Re-released for DXP Platform.; PackageReference: AXIAL-0.3; Publisher: Altium Limited; PackageDescription: Axial Device, Thru-Hole; 2 Leads; 0.3 in Pin Spacing
R?#38 = Res1: Res,0805,100K; Published: 8-Jun-2000; LatestRevisionDate: 17-Jul-2002; LatestRevisionNote: Re-released for DXP Platform.; PackageReference: AXIAL-0.3; Publisher: Altium Limited; PackageDescription: Axial Device, Thru-Hole; 2 Leads; 0.3 in Pin Spacing
R?#44 = RPot: Potentiometer; Sim Note: Enter the Resistance value and the set point into parameter fields.; Set Position: 0.5; Published: 8-Jun-2000; LatestRevisionDate: 17-Jul-2002; LatestRevisionNote: Re-released for DXP Platform.; PackageReference: VR5; Publisher: Altium Limited; PackageDescription: Variable Resistor, Thru-Hole; 3 Leads
R?#45 R?#46 R?#49 = Res0.3: RES SMD 5.1K OHM 1% 1/10W 0603; MANUFACTURER1: Yageo; MANUFACTURER1_PART#: RC0603FR-075K1L; PACKING: Tape & Reel (TR); Process Type: SM; Unit: PCS; Value: 5.1K; CATEGORY: RES SMD
R?#50 R?#51 = Res0.3: RES 22 OHM 5% 1/10W 0603; MANUFACTURER1: Yageo; MANUFACTURER1_PART#: RC0603JR-0722RL; MANUFACTURER2_PART#: RMCF0603JT22R0; PACKING: Tape & Reel (TR); Process Type: SM; Unit: PCS; Power: 0.25W; Value: 22R; CATEGORY: RES SMD; MANUFACTURER2: Stackpole Electronics Inc; Tolerance: 5%
U? = IC_TPS54302DDCR: IC REG BUCK ADJ 3A TSOT23-6,TPS54302DDCR; DISTR1_PART#: 296-46237-1-ND; BY: VINFAST_RD; DISTR1: DIGIKEY; MFG1: Texas Instruments; PROCESS: SM; Category: IC; MFG1_PART#: TPS54302DDCR; TYPE: IC; VFCODE: TPS54302DDCR
Z?#1-Z?#8 = MMSZ4683T1G: Zener Diode; Manufacturer_Name: onsemi; Datasheet Link: https://datasheet.datasheetarchive.com/originals/distributors/Datasheets-23/DSA-455817.pdf; Height: 1.35mm; Manufacturer_Part_Number: MMSZ4683T1G; Mouser Part Number: 863-MMSZ4683T1G; Mouser Price/Stock: https://www.mouser.co.uk/ProductDetail/onsemi/MMSZ4683T1G?qs=P4IOph%252Bbot9v8tpS0oq%2F3Q%3D%3D; Arrow Part Number: MMSZ4683T1G; Arrow Price/Stock: https://www.arrow.com/en/products/mmsz4683t1g/on-semiconductor?region=europe